# Altium schematic sheet Supplies_Isense.SchDoc
size A
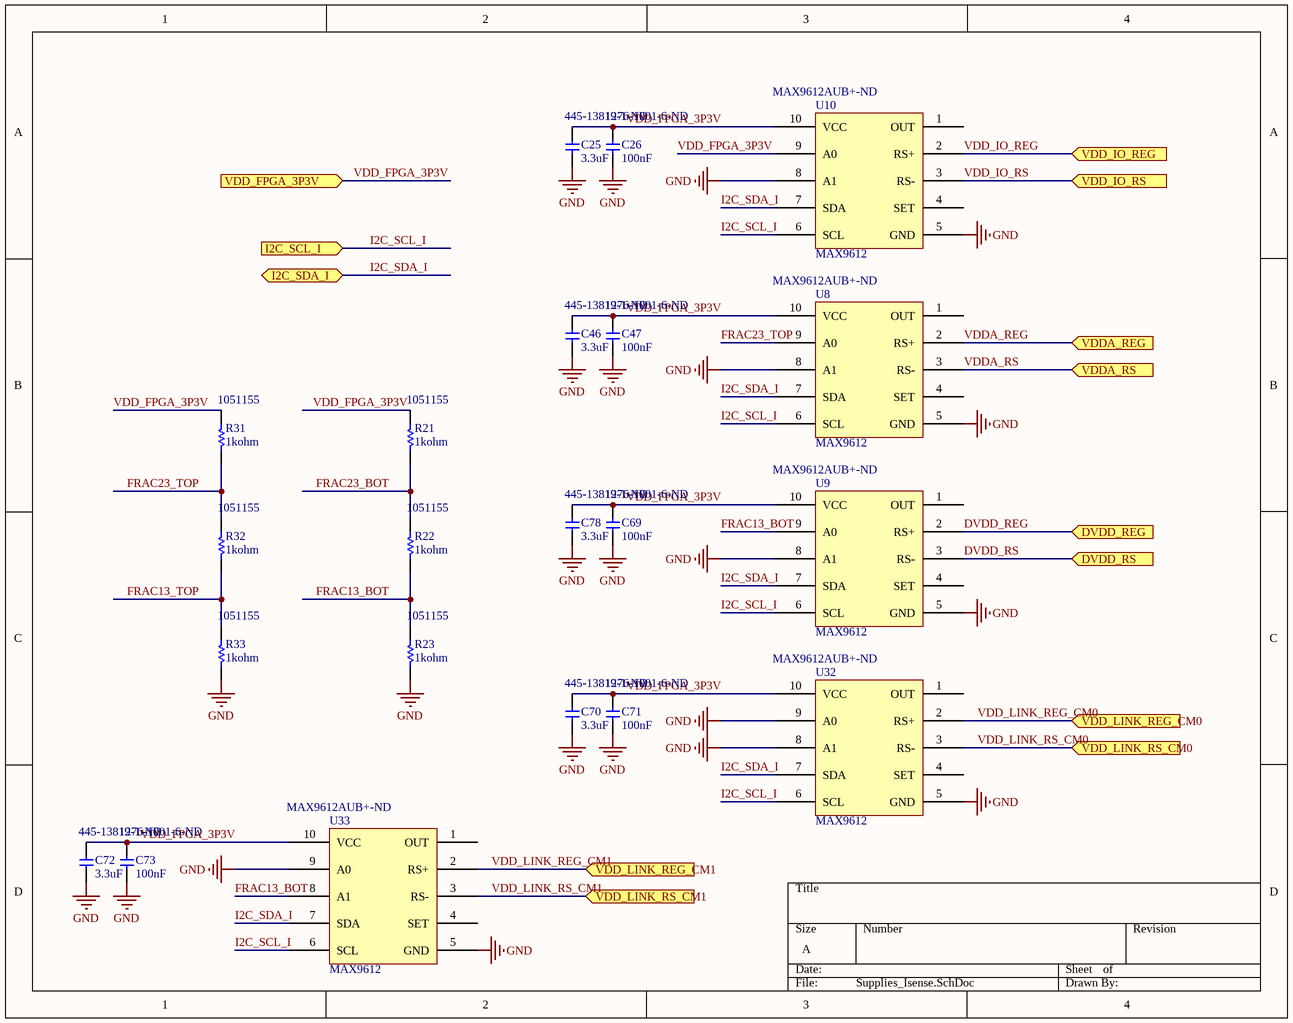
[diagram p0: Supplies_Isense.SchDoc]

## Parts
C25  3.3uF  Supplier Part Number 1: 445-13819-1-ND  [CAP_0402]
C26  100nF  Supplier Part Number 1: 1276-1001-6-ND  [CAP_0402]
C46  3.3uF  Supplier Part Number 1: 445-13819-1-ND  [CAP_0402]
C47  100nF  Supplier Part Number 1: 1276-1001-6-ND  [CAP_0402]
C69  100nF  Supplier Part Number 1: 1276-1001-6-ND  [CAP_0402]
C70  3.3uF  Supplier Part Number 1: 445-13819-1-ND  [CAP_0402]
C71  100nF  Supplier Part Number 1: 1276-1001-6-ND  [CAP_0402]
C72  3.3uF  Supplier Part Number 1: 445-13819-1-ND  [CAP_0402]
C73  100nF  Supplier Part Number 1: 1276-1001-6-ND  [CAP_0402]
C78  3.3uF  Supplier Part Number 1: 445-13819-1-ND  [CAP_0402]
R21  1kohm  Supplier Part Number 1: 1051155  [RES_0603]
R22  1kohm  Supplier Part Number 1: 1051155  [RES_0603]
R23  1kohm  Supplier Part Number 1: 1051155  [RES_0603]
R31  1kohm  Supplier Part Number 1: 1051155  [RES_0603]
R32  1kohm  Supplier Part Number 1: 1051155  [RES_0603]
R33  1kohm  Supplier Part Number 1: 1051155  [RES_0603]
U8  MAX9612  Supplier Part Number 1: MAX9612AUB+-ND  [MAX9612]
U9  MAX9612  Supplier Part Number 1: MAX9612AUB+-ND  [MAX9612]
U10  MAX9612  Supplier Part Number 1: MAX9612AUB+-ND  [MAX9612]
U32  MAX9612  Supplier Part Number 1: MAX9612AUB+-ND  [MAX9612]
U33  MAX9612  Supplier Part Number 1: MAX9612AUB+-ND  [MAX9612]

## Ports
DVDD_REG (in), DVDD_RS (in), I2C_SCL_I (in), I2C_SDA_I (bidir), VDD_FPGA_3P3V (in), VDD_IO_REG (in), VDD_IO_RS (in), VDD_LINK_REG_CM0 (in), VDD_LINK_REG_CM1 (in), VDD_LINK_RS_CM0 (in), VDD_LINK_RS_CM1 (in), VDDA_REG (in), VDDA_RS (in)

## Nets
GND: C25.2 C26.2 C46.2 C47.2 C69.2 C70.2 C71.2 C72.2 C73.2 C78.2 R23.2(BOT) R33.2(BOT) U8.5(GND) U8.8(A1) U9.5(GND) U9.8(A1) U10.5(GND) U10.8(A1) U32.5(GND) U32.8(A1) U32.9(A0) U33.5(GND) U33.9(A0)
DVDD_REG: U9.2(RS+) ; port DVDD_REG
DVDD_RS: U9.3(RS-) ; port DVDD_RS
FRAC13_BOT: R22.2(BOT) R23.1(TOP) U9.9(A0) U33.8(A1)
FRAC13_TOP: R32.2(BOT) R33.1(TOP)
FRAC23_BOT: R21.2(BOT) R22.1(TOP)
FRAC23_TOP: R31.2(BOT) R32.1(TOP) U8.9(A0)
I2C_SCL_I: U8.6(SCL) U9.6(SCL) U10.6(SCL) U32.6(SCL) U33.6(SCL) ; port I2C_SCL_I
I2C_SDA_I: U8.7(SDA) U9.7(SDA) U10.7(SDA) U32.7(SDA) U33.7(SDA) ; port I2C_SDA_I
VDD_FPGA_3P3V: C25.1 C26.1 C46.1 C47.1 C69.1 C70.1 C71.1 C72.1 C73.1 C78.1 R21.1(TOP) R31.1(TOP) U8.10(VCC) U9.10(VCC) U10.9(A0) U10.10(VCC) U32.10(VCC) U33.10(VCC) ; port VDD_FPGA_3P3V
VDD_IO_REG: U10.2(RS+) ; port VDD_IO_REG
VDD_IO_RS: U10.3(RS-) ; port VDD_IO_RS
VDD_LINK_REG_CM0: U32.2(RS+) ; port VDD_LINK_REG_CM0
VDD_LINK_REG_CM1: U33.2(RS+) ; port VDD_LINK_REG_CM1
VDD_LINK_RS_CM0: U32.3(RS-) ; port VDD_LINK_RS_CM0
VDD_LINK_RS_CM1: U33.3(RS-) ; port VDD_LINK_RS_CM1
VDDA_REG: U8.2(RS+) ; port VDDA_REG
VDDA_RS: U8.3(RS-) ; port VDDA_RS

Not connected (* = marked no-connect by the designer): U8 1(OUT) 4(SET); U9 1(OUT) 4(SET); U10 1(OUT) 4(SET); U32 1(OUT) 4(SET); U33 1(OUT) 4(SET)

## Library data of the parts
C25 C46 C70 C72 C78 = cap 3p3uF: CAP CER 3.3uF 10% 10V X5R 0402; Manufacturer: TDK; Manufacturer ID: C1005X5R1A335K050BC; Digikey ID: 445-13819-1-ND; Value: 3.3uF; Package: 0402; Supplier 1: Digi-Key
C26 C47 C69 C71 C73 = cap 100nF: CAP CER 0.1uF 10% 16V X7R 0402; Manufacturer: Samsung Electro-Mechanics; Manufacturer ID: CL05B104KO5NNNC; Digikey ID: 1276-1001-1-ND; Value: 0.1uF; Package: 0402; Supplier 1: Digi-Key
R21-R23 R31-R33 = res 1 Kohm: RES SMD 1K OHM 1% 1/10W 0603; Manufacturer: Panasonic; Manufacturer ID: ERJ-3EKF1001V; Digikey ID: P1.00KHCT-ND; Package: 0603; Supplier 1: RSComponents
U8-U10 U32 U33 = MAX9612: OpAmp ADC; Manufacturer: Maxim; Manufacturer ID: MAX9612AUB+; Digikey ID: MAX9612AUB+-ND; Supplier 1: Digi-Key